# EAGLE design aircom (EAGLE 5.11)
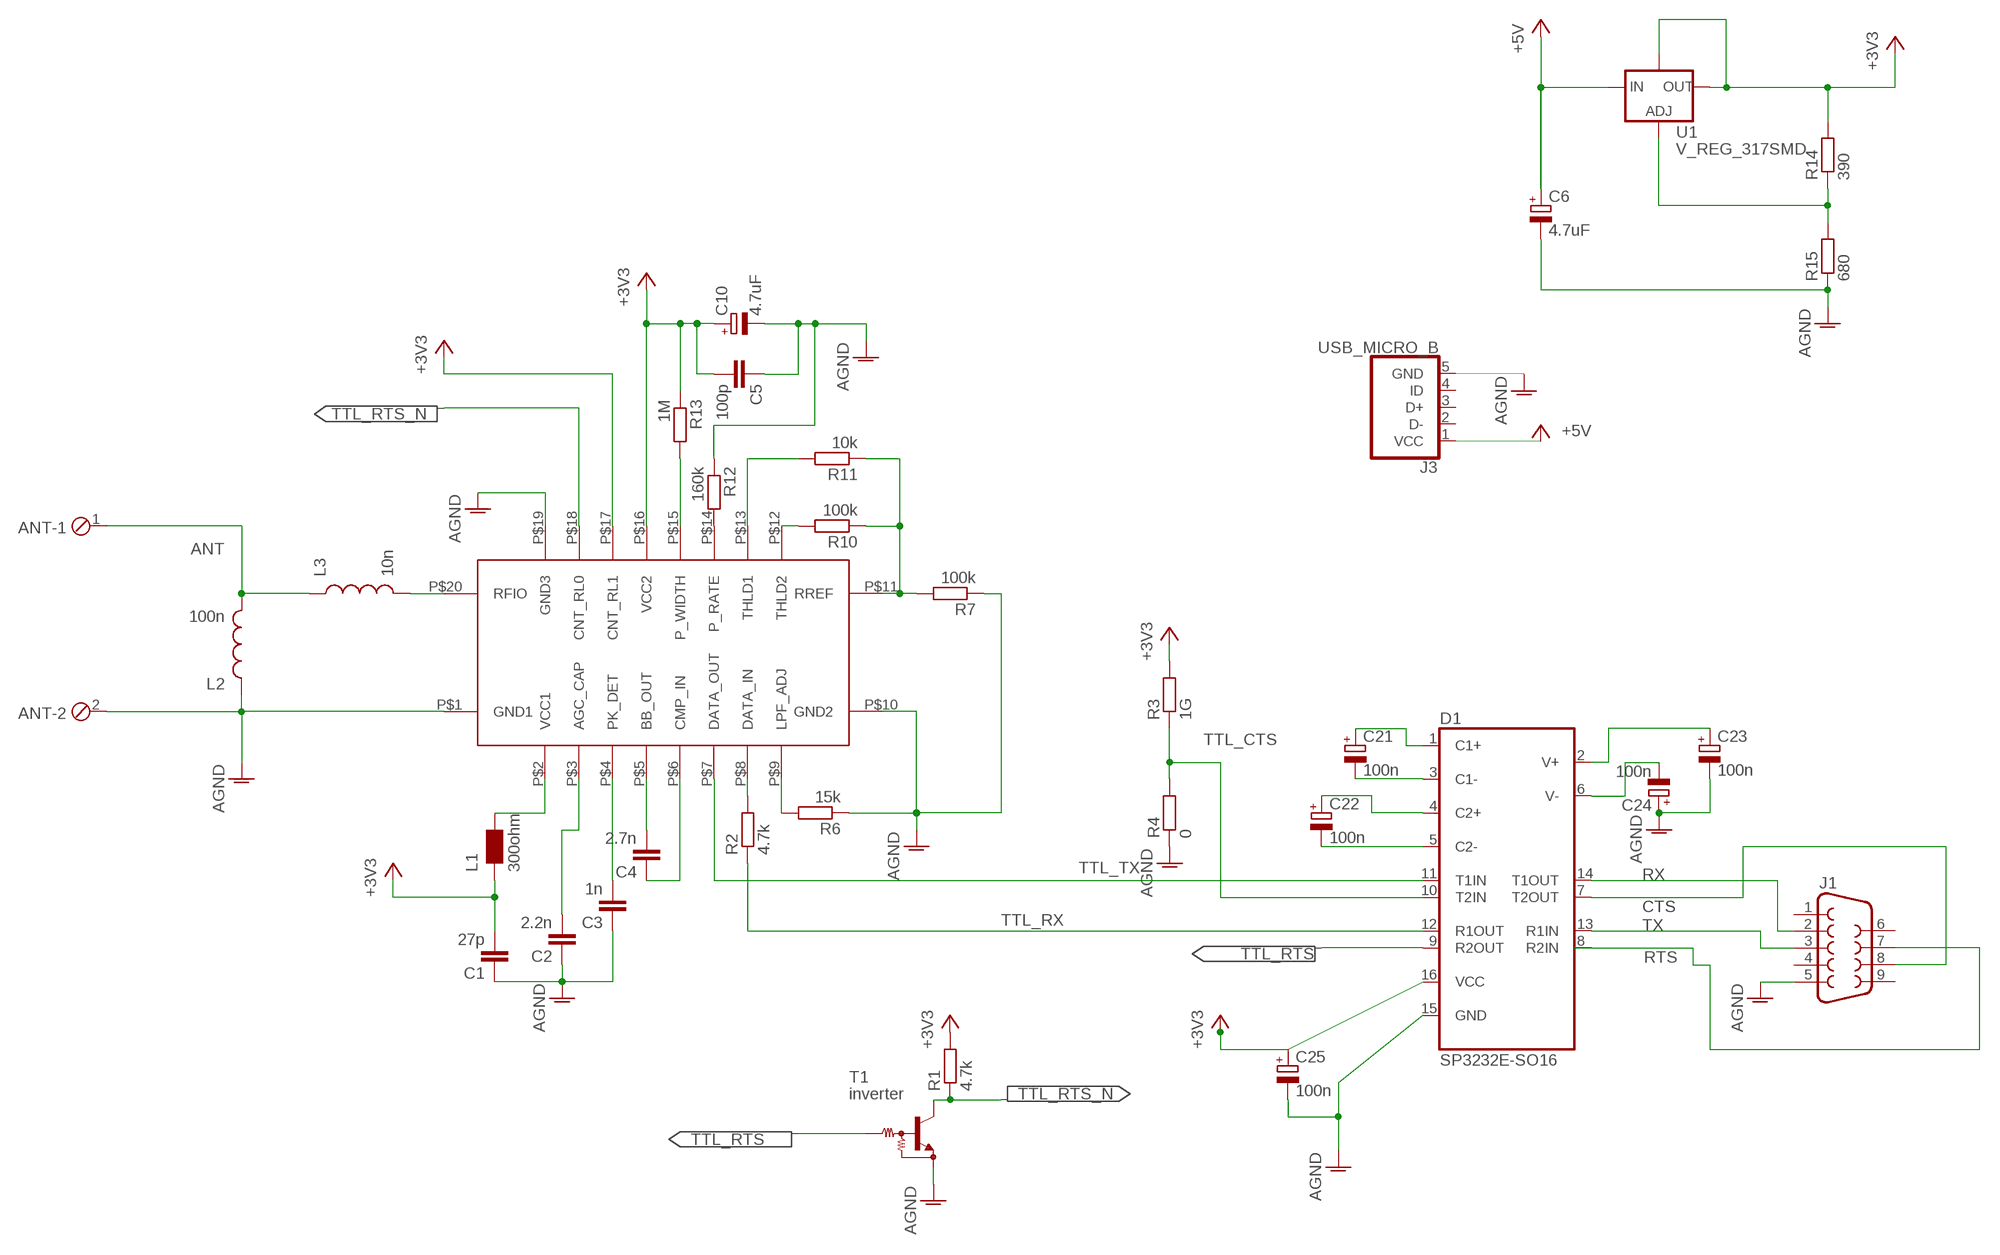
[diagram p0: schematic, sheet 1]

## Parts
ANT  MPT2  [2POL254]
C1  27p  C-EUC0603  [C0603]
C2  2.2n  C-EUC0603  [C0603]
C3  1n  C-EUC0603  [C0603]
C4  2.7n  C-EUC0603  [C0603]
C5  100p  C-EUC0603  [C0603]
C6  4.7uF  CAP_SMBB  [SMC_CAP_B]
C10  4.7uF  CAP_SMBB  [SMC_CAP_B]
C21  100n  CAP_SMBA  [SMC_CAP_A]
C22  100n  CAP_SMBA  [SMC_CAP_A]
C23  100n  CAP_SMBA  [SMC_CAP_A]
C24  100n  CAP_SMBA  [SMC_CAP_A]
C25  100n  CAP_SMBA  [SMC_CAP_A]
D1  SP3232E-SO16  [SO16]
J1  DB9FEMALE  [DB9]
J3  USB_MICRO_B  [USB_MICRO_B]
L1  300ohm  WE-CBF_0603  [0603]
L2  100n  INDUCTOR_SMD  [0805]
L3  10n  INDUCTOR_SMD  [0805]
R1  4.7k  R-EU_R0603  [R0603]
R2  4.7k  R-EU_R0603  [R0603]
R3  1G  R-EU_R0603  [R0603]
R4  0  R-EU_R0603  [R0603]
R6  15k  R-EU_R0603  [R0603]
R7  100k  R-EU_R0603  [R0603]
R10  100k  R-EU_R0603  [R0603]
R11  10k  R-EU_R0603  [R0603]
R12  160k  R-EU_R0603  [R0603]
R13  1M  R-EU_R0603  [R0603]
R14  390  R-EU_R0603  [R0603]
R15  680  R-EU_R0603  [R0603]
T1  inverter  NPN-DRIVER  [SC59_EBC]
U1  V_REG_317SMD  [SOT223]
U$2  TR1001  [TR1001]

## Nets
+3V3: C1.2 C5.2 C10.+ C25.+ D1.16(VCC) L1.1 R1.2 R3.2 R13.1 R14.2 U1.2(OUT) U1.4(OUT_TOP) U$2.P$16(VCC2) U$2.P$17(CNT_RL1)
+5V: C6.+ J3.1(VCC) U1.3(IN)
AGND: ANT.2 C1.1 C2.1 C3.1 C5.1 C6.- C10.- C23.- C24.+ C25.- D1.15(GND) J1.5 J3.5(GND) L2.1 R4.1 R6.1 R7.1 R12.1 R15.1 T1.E U$2.P$1(GND1) U$2.P$10(GND2) U$2.P$19(GND3)
ANT: ANT.1 L2.2 L3.1
CTS: D1.7(T2OUT) J1.8
N$1: L3.2 U$2.P$20(RFIO)
N$2: L1.2 U$2.P$2(VCC1)
N$3: C24.- D1.6(V-)
N$4: C2.2 U$2.P$3(AGC_CAP)
N$5: C3.2 U$2.P$4(PK_DET)
N$6: R14.1 R15.2 U1.1(ADJ)
N$7: C4.2 U$2.P$5(BB_OUT)
N$8: C4.1 U$2.P$6(CMP_IN)
N$9: C23.+ D1.2(V+)
N$10: R2.2 U$2.P$8(DATA_IN)
N$12: R6.2 U$2.P$9(LPF_ADJ)
N$13: R7.2 R10.1 R11.1 U$2.P$11(RREF)
N$14: C21.+ D1.1(C1+)
N$15: R10.2 U$2.P$12(THLD2)
N$16: R11.2 U$2.P$13(THLD1)
N$17: R12.2 U$2.P$14(P_RATE)
N$18: R13.2 U$2.P$15(P_WIDTH)
N$19: C21.- D1.3(C1-)
N$20: C22.+ D1.4(C2+)
N$21: C22.- D1.5(C2-)
RTS: J1.7
RX: D1.14(T1OUT) J1.2
TTL_CTS: D1.10(T2IN) R3.1 R4.2
TTL_RTS: D1.9(R2OUT) T1.B
TTL_RTS_N: R1.1 T1.C U$2.P$18(CNT_RL0)
TTL_RX: D1.12(R1OUT) R2.1
TTL_TX: D1.11(T1IN) U$2.P$7(DATA_OUT)
TX: D1.13(R1IN) J1.3
Unconnected: D1.8(R2IN) J1.1 J1.4 J1.6 J1.9 J3.2(D-) J3.3(D+) J3.4(ID)

## Library data of the parts
ANT = con-phoenix-254:MPT2: PHOENIX CONNECTOR; OC_FARNELL: unknown; OC_NEWARK: unknown
C1-C5 = rcl:C-EU: CAPACITOR, European symbol
C6 C10 C21-C25 = jockes_lib:CAP_SMB
D1 = jockes_lib:SP3232E
J1 = SparkFun:DB9: DB9 Connector Standard DB9 (D-Sub 9) serial connector. Can be used for CAN bus as well as RS485 and RS232. Footprint production proven. Spark Fun Electronics SKU : PRT-00429
J3 = jockes_lib:USB_MICRO_B
L1 = wuerth-elektronik:WE-CBF: SMD EMI Suppression Ferrite Beads - excellent anti-EMI properties - low DCR - impedances till 3000 ohms - rated current up to 6 A
L2 L3 = jockes_lib:INDUCTOR_SMD
R1-R4 R6 R7 R10-R15 = resistor:R-EU_: RESISTOR, European symbol
T1 = jockes_lib:NPN-DRIVER
U1 = SparkFun:V_REG_317: Voltage Regulator Standard LM317 adjustable voltage regulator. AOI (Adjust Output Input). Google 'LM317 Calculator' for easy to use app to get the two resistor values needed. 240/720 for 5V output. 240/390 for 3.3V output. Spark Fun Electronics SKU : COM-00527
U$2 = jockes_lib:TR1001

## Board
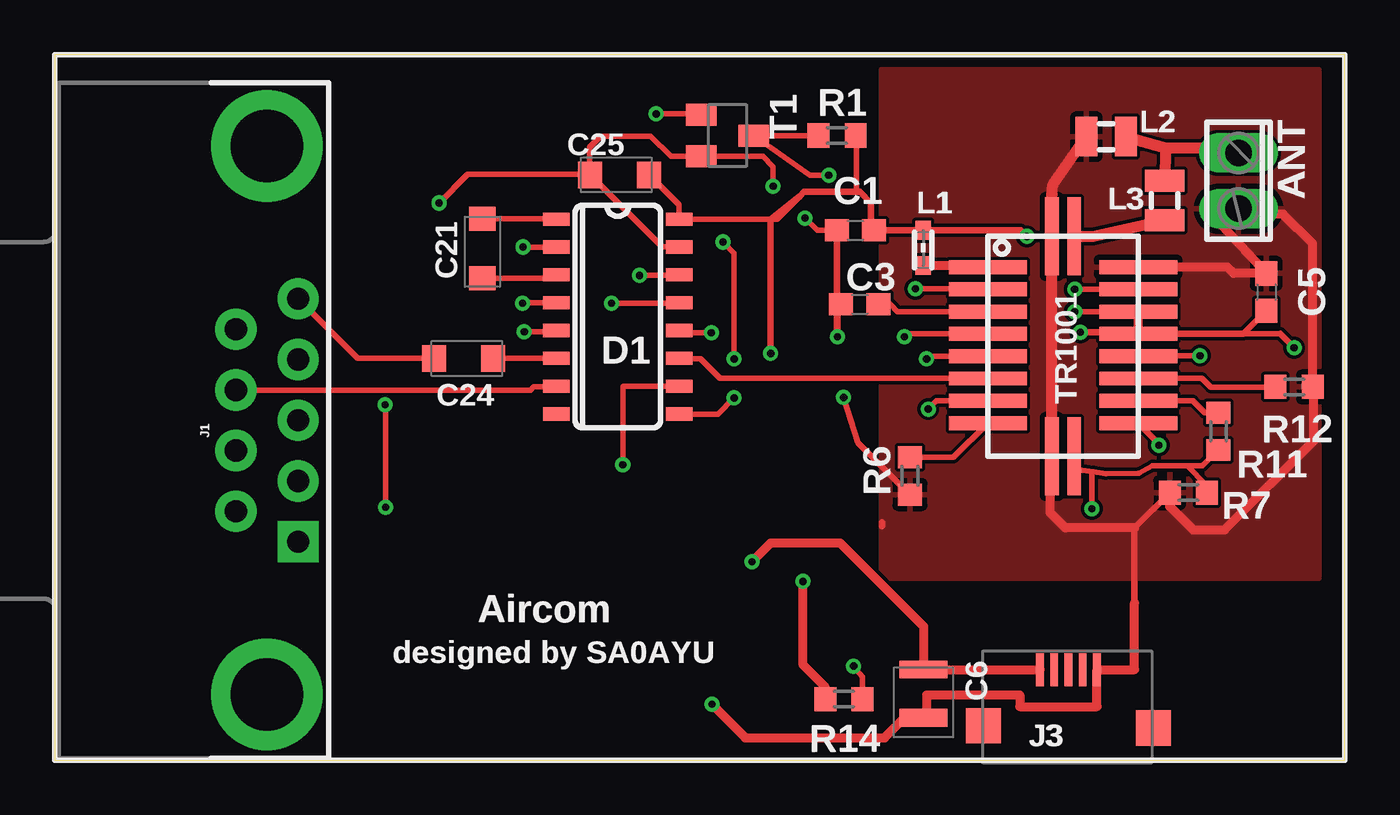
[diagram p1: board, top side]
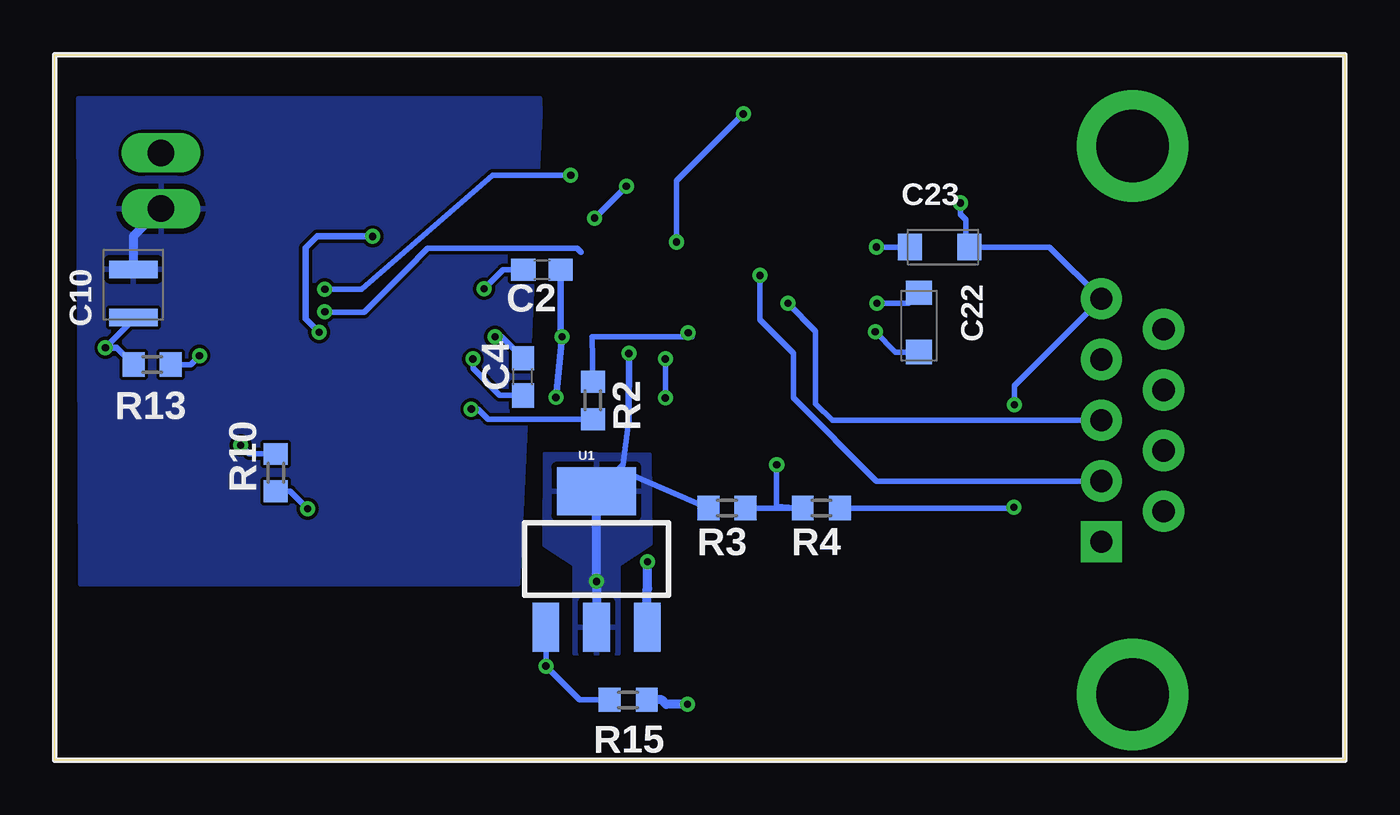
[diagram p2: board, bottom side, seen from below]

Size 58.84 x 32.16 mm. Coordinates in mm from the lower left corner, seen from the top.
Outline: 0,0 58.84,0 58.84,32.16 0,32.16 0,0
Copper layers (1*16): Top 0.0356mm / dielectric 1.5011mm / Bottom 0.0356mm
Design rules "LaenPCBOrder *": minimum track width 6mil, minimum drill 13mil, track to track 6mil, track to pad 6mil, pad to pad 6mil, via to via 6mil, smd to smd 6mil, copper to edge 15mil, drill to drill 6mil, minimum pad ring 7mil, minimum via ring 7mil, stop-mask expansion 4mil, vias tented up to drill 0mil, thermal gap 10mil

### Footprints (pad centres in the part's own frame; a part is rotated, then mirrored left to right if it is on the bottom)
2POL254 = drill 1.2 long: 1 -1.27,0; 2 1.27,0
C0603 = smd 1.1 x 1: 1 -0.85,0; 2 0.85,0
SMC_CAP_B = smd 0.8 x 2.2: + -1.37,0.3; - 0.83,0.3
SMC_CAP_A = smd 1.1 x 1.2: + 0.23,1.2; - 2.93,1.2
SO16 = smd 1.2 x 0.6: 1 -2.8,3.175; 2 -2.8,1.905; 3 -2.8,0.635; 4 -2.8,-0.635; 5 -2.8,-1.905; 6 -2.8,-3.175; 7 -2.8,-4.445; 8 -2.8,-5.715; 9 2.8,-5.715; 10 2.8,-4.445; 11 2.8,-3.175; 12 2.8,-1.905; 13 2.8,-0.635; 14 2.8,0.635; 15 2.8,1.905; 16 2.8,3.175
DB9 = drill 1.016 pad 1.88 square: 1 -5.54,-1.42 | drill 1.016 pad 1.88 round: 2 -2.77,-1.42; 3 0,-1.42; 4 2.77,-1.42; 5 5.54,-1.42; 6 -4.15,1.42; 7 -1.38,1.42; 8 1.38,1.42; 9 4.15,1.42 | drill 3.302 pad 5.08 round: G1 -12.5,0; G2 12.5,0
USB_MICRO_B = smd 0.35 x 1.5: 1 -0.38,-1.58; 2 -1.03,-1.58; 3 -1.68,-1.58; 4 -2.33,-1.58; 5 -2.98,-1.58 | smd 1.6 x 1.6: 6 -5.55,1.08; 7 2.2,0.97
0603 = smd 0.85 x 0.7: 1 -0.9,0; 2 0.7,0
0805 = smd 1 x 1.8: 1 -0.87,0.02; 2 0.93,0.02
R0603 = smd 1 x 1.1: 1 -0.85,0; 2 0.85,0
SC59_EBC = smd 1 x 1.4: B -0.95,-1.2; C 0,1.2; E 0.95,-1.2
SOT223 = smd 1.219 x 2.235: 1 -2.311,-3.099; 2 0,-3.099; 3 2.311,-3.099 | smd 3.6 x 2.2: 4 0,3.099
TR1001 = smd 3.556 x 0.635: P$1 0,2.921; P$10 10.033,2.921; P$11 10.033,3.937; P$20 0,3.937 | smd 0.635 x 3.556: P$2 1.397,0; P$3 2.413,0; P$4 3.429,0; P$5 4.445,0; P$6 5.461,0; P$7 6.477,0; P$8 7.493,0; P$9 8.509,0; P$12 8.509,6.858; P$13 7.493,6.858; P$14 6.477,6.858; P$15 5.461,6.858; P$16 4.445,6.858; P$17 3.429,6.858; P$18 2.413,6.858; P$19 1.397,6.858

### Placement (x,y rotation side)
ANT  53.99,26.42 270 top
C1  36.52,24.15 0 top
C2  36.62,22.35 180 bottom
C3  36.72,20.78 0 top
C4  37.48,17.48 90 bottom
C5  55.26,21.34 270 top
C6  39.32,2.76 270 top
C10  54.96,21.54 90 bottom
C21  18.31,24.91 270 top
C22  20.62,21.53 270 bottom
C23  20.06,22.19 0 bottom
C24  17.07,17.11 0 top
C25  27.34,27.88 180 top
D1  25.68,21.49 0 top
J1  9.68,15.49 90 top
J3  44.55,2.54 180 top
L1  39.61,23.26 270 top
L2  47.93,28.4 0 top
L3  50.61,25.54 270 top
R1  35.68,28.48 0 top
R2  34.29,16.4 270 bottom
R3  28.17,11.49 180 bottom
R4  23.87,11.49 180 bottom
R6  39,12.95 90 top
R7  51.7,12.19 0 top
R10  48.76,13.11 90 bottom
R11  53.08,14.99 90 top
R12  56.53,17.02 180 top
R13  54.4,18.03 0 bottom
R14  36,2.78 180 top
R15  32.69,2.74 180 bottom
T1  30.68,28.48 270 top
U1  34.13,9.16 0 bottom
U$2  42.56,23.88 270 top

### Tracks (layer width: path | path; a pad name or v marks a point on that pad's centre or on a via)
+3V3  (via drill 0.33)
  Top 0.254: 54.21,19.43 55.9,19.43 | U$2.P$17 v46.52,20.45 | R1.2 36.58,28.48 36.58,25.91 | 33.98,25.71 32.94,24.67 D1.16 28.48,25.31 C25.+
  Top 0.305: v32.65,18.54 32.65,24.64 33.98,25.71 34.18,25.91 36.58,25.91 36.72,25.91 37.23,25.4 37.23,24.3 C1.2 L1.1 44.06,24.16 v44.34,23.88 | v46.78,19.51 49.34,19.51 | U$2.P$16 54.21,19.43 C5.2 | 55.9,19.43 v56.53,18.8
  Top 0.406: R14.2 35.15,3.31 34.13,4.33 v34.13,8.14 | U$2.P$17 U$2.P$16 49.34,19.43 49.34,19.51
  Bottom 0.254: 34.83,23.16 35.02,23.34 41.82,23.34 42.31,22.86 42.31,22.83 44.72,20.42 46.5,20.42 v46.52,20.45 | R3.2 33.12,13.27 U1.4 32.92,13.47 32.66,15.42
  Bottom 0.305: 32.66,15.42 v32.65,18.54 | v44.34,23.88 46.88,23.88 47.39,23.37 47.39,20.12 v46.78,19.51 | R13.1 56.01,18.8 v56.53,18.8 55.26,20.07 C10.+
  Bottom 0.406: U1.2 v34.13,8.14 U1.4
  pour Bottom: 35.14,4.84 35.14,8.91 36.52,9.79 36.49,13.99 31.69,13.94 31.64,9.87 33.11,8.91 33.11,4.84
+5V  (via drill 0.33)
  Top 0.406: J3.1 C6.+ 39.62,6.1 35.81,9.91 32.66,9.91 v31.8,9.04
  Bottom 0.406: U1.3 31.82,7.8 31.8,7.82 v31.8,9.04
AGND  (via drill 0.33)
  Top 0.254: D1.15 27.7,23.4 C25.- 24.38,26.71 | v35.98,16.53 36.63,14.48 R6.1 | 24.38,26.71 24.38,27.94 24.89,28.45 27.18,28.45 28.1,27.53 T1.E 32.3,27.53 32.77,27.06 v32.77,26.16 | 24.38,26.71 18.84,26.71 v17.53,25.4 | C24.+ 13.82,18.31 J1.5 | v15.09,11.53 15.09,16.18 v15.06,16.2 | C1.1 34.78,24.15 v34.21,24.71
  Top 0.305: C3.1 35.7,20.61 v35.7,19.3 35.67,19.33 C1.1 | 49.25,7.16 49.25,10.58 R7.1 | 37.73,10.83 37.73,10.67
  Top 0.406: 49.25,10.58 46.1,10.58 45.41,11.28 45.41,13.77 U$2.P$10 | R7.1 50.85,11.57 51.93,10.49 53.36,10.49 57.42,14.55 57.42,16.98 R12.1 57.38,23.53 56.02,24.89 54.24,24.89 ANT.2 53.23,24.38 C5.1 53.78,22.19 53.48,22.48 U$2.P$19 | 49.25,7.16 49.25,4.12 J3.5 47.53,2.44 44.02,2.44 44.02,2.97 39.78,2.97 39.78,1.93 C6.- 38.76,1.93 37.85,1.02 31.5,1.02 v29.97,2.54
  Top 0.508: U$2.P$10 U$2.P$1 45.48,25.78 45.53,26.24 L2.1
  Bottom 0.254: v17.53,25.4 17.53,24.89 17.27,24.64 17.27,23.54 C23.- 13.46,23.39 J1.5 15.06,17.07 v15.06,16.2 | R4.1 15.13,11.49 v15.09,11.53 | v34.21,24.71 v32.77,26.16
  Bottom 0.305: C2.1 35.77,19.37 v35.7,19.3 v35.98,16.53
  Bottom 0.406: R15.1 31.15,2.74 30.95,2.54 v29.97,2.54 | C10.- 55.26,23.88 ANT.2
  pour Top: 37.68,31.49 57.68,31.49 57.68,8.27 37.68,8.27
  pour Bottom: 36.69,30.18 57.77,30.18 57.68,8.02 37.7,8.02 36.68,29.48
ANT
  Top 0.508: 50.65,27.92 L3.1 | L2.2 50.65,27.92 | 50.65,27.92 53.76,27.92 ANT.1
CTS
  Top 0.254: J1.8 21.7,16.87 21.84,17.02 22.85,17.02 D1.7
N$1
  Top 0.508: U$2.P$20 47.35,23.88 L3.2
N$2
  Top 0.406: L1.2 42.48,22.56 U$2.P$2
N$3
  Top 0.254: C24.- D1.6
N$4  (via drill 0.33)
  Top 0.254: v39.26,21.49 42.54,21.49 U$2.P$3
  Bottom 0.254: C2.2 38.39,22.35 v39.26,21.49
N$5
  Top 0.254: U$2.P$4 38.45,20.45 38.12,20.78 C3.2
N$6  (via drill 0.33)
  Top 0.254: R14.1 36.85,3.8 v36.44,4.28
  Bottom 0.254: U1.1 v36.44,4.28 34.9,2.74 R15.2
N$7  (via drill 0.33)
  Top 0.254: U$2.P$5 38.88,19.43 v38.75,19.3
  Bottom 0.254: v38.75,19.3 38.46,19.3 C4.2
N$8  (via drill 0.33)
  Top 0.254: U$2.P$6 39.89,18.41 v39.77,18.29
  Bottom 0.254: v39.77,18.29 39.77,17.86 38.55,16.64 37.49,16.64 C4.1
N$9  (via drill 0.33)
  Top 0.254: v21.36,23.39 D1.2
  Bottom 0.254: C23.+ v21.36,23.39
N$10  (via drill 0.33)
  Top 0.254: v39.84,16 40.22,16.38 U$2.P$8
  Bottom 0.254: R2.2 39.07,15.54 39.52,16 v39.84,16
N$12
  Top 0.254: R6.2 41,13.8 U$2.P$9
N$13  (via drill 0.33)
  Top 0.254: U$2.P$11 46.5,13.26 47.38,13.14 | 47.38,13.14 47.95,13.06 49.44,13.08 50.05,13.41 51.65,13.41 | 51.65,13.41 52.5,12.56 52.5,12.24 R7.2 | v47.31,11.45 47.31,13.07 47.38,13.14 | 51.65,13.41 52.35,13.41 R11.1
  Bottom 0.254: R10.1 48.11,12.26 v47.31,11.45
N$14
  Top 0.254: C21.+ D1.1
N$15  (via drill 0.33)
  Top 0.254: v50.36,14.35 50.36,14.43 U$2.P$12
  Bottom 0.254: R10.2 49.96,13.96 v50.36,14.35
N$16
  Top 0.254: R11.2 52.45,15.84 51.91,16.38 U$2.P$13
N$17
  Top 0.254: U$2.P$14 52.31,17.4 52.72,16.99 55.66,16.99 R12.2
N$18  (via drill 0.33)
  Top 0.254: v52.24,18.44 49.44,18.44 U$2.P$15
  Bottom 0.254: R13.2 52.64,18.03 v52.24,18.44
N$19
  Top 0.254: C21.- 22.73,21.98 D1.3
N$20  (via drill 0.33)
  Top 0.254: D1.4 21.37,20.86 v21.34,20.83
  Bottom 0.254: v21.34,20.83 19.89,20.83 C22.+
N$21  (via drill 0.33)
  Top 0.254: v21.41,19.53 22.83,19.53 D1.5
  Bottom 0.254: C22.- 20.48,18.6 v21.41,19.53
RX  (via drill 0.33)
  Top 0.254: v26.67,22.1 28.45,22.1 D1.14
  Bottom 0.254: J1.2 21.36,12.72 25.15,16.51 25.15,18.54 26.67,20.07 v26.67,22.1
TTL_CTS  (via drill 0.33)
  Top 0.254: D1.10 25.94,17.05 25.91,17.02 v25.91,13.46
  Bottom 0.254: R3.1 R4.2 25.91,11.58 v25.91,13.46
TTL_RTS  (via drill 0.33)
  Top 0.254: D1.9 30.26,15.78 v30.99,16.51 | v30.99,18.29 30.99,23.11 v30.48,23.62 | v27.43,29.46 29.44,29.46 T1.B
  Bottom 0.254: v30.99,16.51 v30.99,18.29 | v30.48,23.62 30.48,26.42 v27.43,29.46
TTL_RTS_N  (via drill 0.33)
  Top 0.254: v46.52,21.46 U$2.P$18 | R1.1 T1.C 34.45,26.67 v35.31,26.67
  Bottom 0.254: v46.52,21.46 44.85,21.46 38.88,26.67 v35.31,26.67
TTL_RX  (via drill 0.33)
  Top 0.254: v29.95,19.48 28.59,19.48 D1.12
  Bottom 0.254: R2.1 34.34,19.29 29.77,19.3 v29.95,19.48
TTL_TX
  Top 0.254: U$2.P$7 30.35,17.4 29.46,18.29 28.51,18.29 D1.11
TX  (via drill 0.33)
  Top 0.254: v25.4,20.83 28.45,20.83 D1.13
  Bottom 0.254: J1.3 23.37,15.49 24.13,16.26 24.13,19.56 v25.4,20.83

### Text on the board
tNames: Aircom | designed by SA0AYU
tDocu: B | C
_tsilk: T1 | C25 | R1 | L2 | ANT | C21 | C1 | L1 | L3 | C5 | C3 | TR1001 | D1 | C24 | R12 | J1 | R11 | R6 | R7 | Aircom | designed by SA0AYU | C6 | R14 | J3
_bsilk: C23 | C22 | C2 | C10 | R2 | C4 | R13 | U1 | R10 | R4 | R3 | R15